# Altium schematic sheet MPU9250.SchDoc
size A4
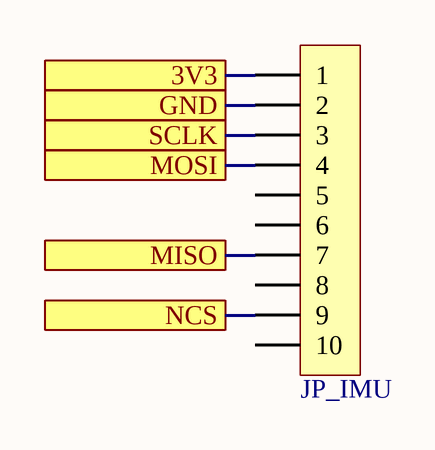
[diagram p0: MPU9250.SchDoc]

## Parts
JP_IMU  HDR-1X10  [HDR2.54-LI-10P]  (value not drawn)

## Ports
3V3, GND, MISO, MOSI, NCS, SCLK

## Nets
3V3: JP_IMU.1 ; port 3V3
GND: JP_IMU.2 ; port GND
MISO: JP_IMU.7 ; port MISO
MOSI: JP_IMU.4 ; port MOSI
NCS: JP_IMU.9 ; port NCS
SCLK: JP_IMU.3 ; port SCLK

Not connected (* = marked no-connect by the designer): JP_IMU 5 6 8 10

## Library data of the parts
JP_IMU = Header 10: 10P接插件; 版权归属: 源创客; BOM名称: 10P接插件; 学习资源: www.ooocke.com